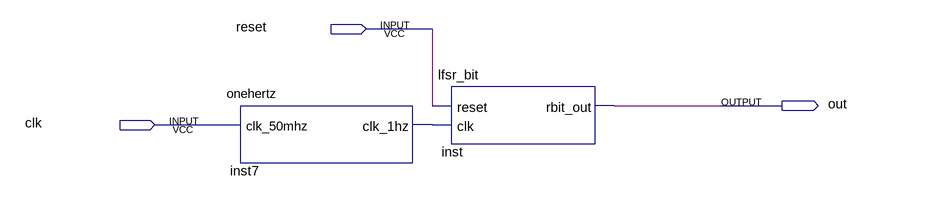
[diagram p0: schematic sheet]
// Quartus schematic rand_test.bdf as structural Verilog: 2 symbols, 3 pins
module rand_test (
  input  reset,
  input  clk,
  output out
);

  wire inst7_clk_1hz;

  onehertz inst7 (.clk_50mhz(clk), .clk_1hz(inst7_clk_1hz));
  lfsr_bit inst (.reset(reset), .clk(inst7_clk_1hz), .rbit_out(out));
endmodule
